# EAGLE design H00R2 (EAGLE 9.6.1)
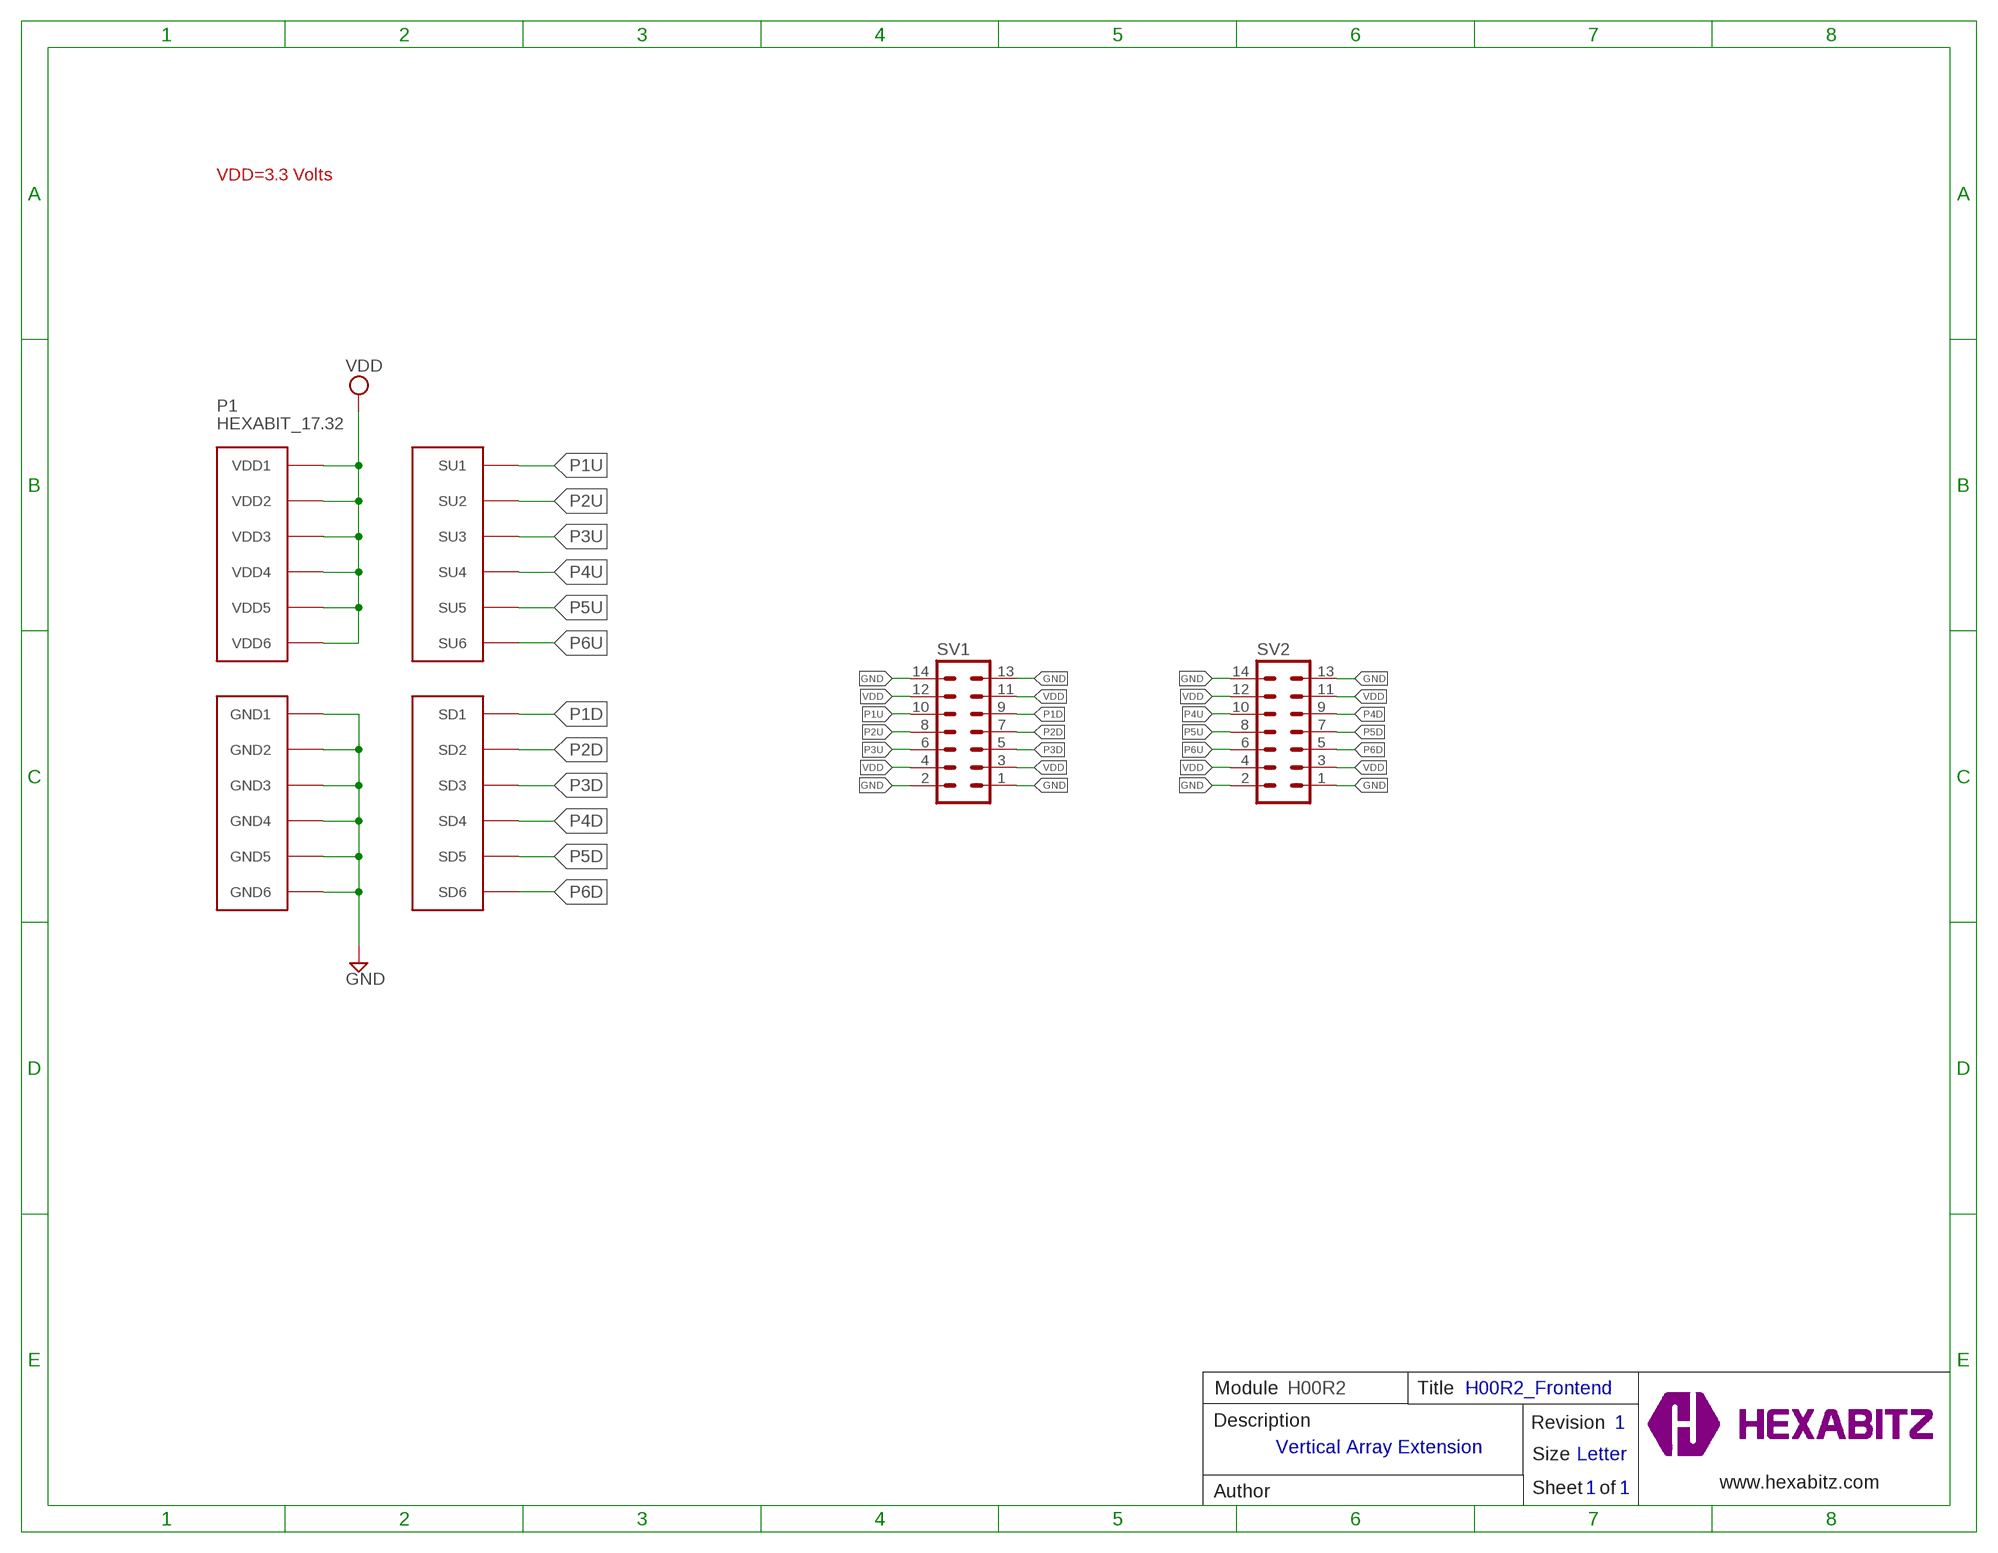
[diagram p0: schematic, sheet 1]

## Parts
P1  HEXABIT_17.32  [HEXABIT_17.32]
SV1  MA07-2  [MA07-2]
SV2  MA07-2  [MA07-2]
TRIMBLE-LOGO1  HEXA-LOGO  [HEXA-LOGO]

## Nets
GND: P1.PAD_PD7(GND1) P1.PAD_PD8(GND2) P1.PAD_PD9(GND3) P1.PAD_PD10(GND4) P1.PAD_PD11(GND5) P1.PAD_PD12(GND6) SV1.1 SV1.2 SV1.13 SV1.14 SV2.1 SV2.2 SV2.13 SV2.14
P1D: P1.PAD_PD1(SD1) SV1.9
P1U: P1.PAD_PU1(SU1) SV1.10
P2D: P1.PAD_PD2(SD2) SV1.7
P2U: P1.PAD_PU2(SU2) SV1.8
P3D: P1.PAD_PD3(SD3) SV1.5
P3U: P1.PAD_PU3(SU3) SV1.6
P4D: P1.PAD_PD4(SD4) SV2.9
P4U: P1.PAD_PU4(SU4) SV2.10
P5D: P1.PAD_PD5(SD5) SV2.7
P5U: P1.PAD_PU5(SU5) SV2.8
P6D: P1.PAD_PD6(SD6) SV2.5
P6U: P1.PAD_PU6(SU6) SV2.6
VDD: P1.PAD_PU7(VDD1) P1.PAD_PU8(VDD2) P1.PAD_PU9(VDD3) P1.PAD_PU10(VDD4) P1.PAD_PU11(VDD5) P1.PAD_PU12(VDD6) SV1.3 SV1.4 SV1.11 SV1.12 SV2.3 SV2.4 SV2.11 SV2.12

## Notes on the sheet
- VDD=3.3 Volts
- Module | H00R2 | Title | H00R2_Frontend
- Description | Revision | 1
- Vertical Array Extension
- Size | Letter
- www.hexabitz.com
- Author | Sheet   of | 1 | 1

## Library data of the parts
P1 = hexabitz_connectors:HEXABIT_?: Hexabitz Hexagon Module Connector Hexagon side length = 28.87mm.
SV1 SV2 = Hexabitz:MA07-2: PIN HEADER; OC_FARNELL: unknown; OC_NEWARK: unknown
TRIMBLE-LOGO1 = HEXABITZ_USER_INTERFACE_PARTS:HEXA-LOGO: Trimble-Logo

## Board
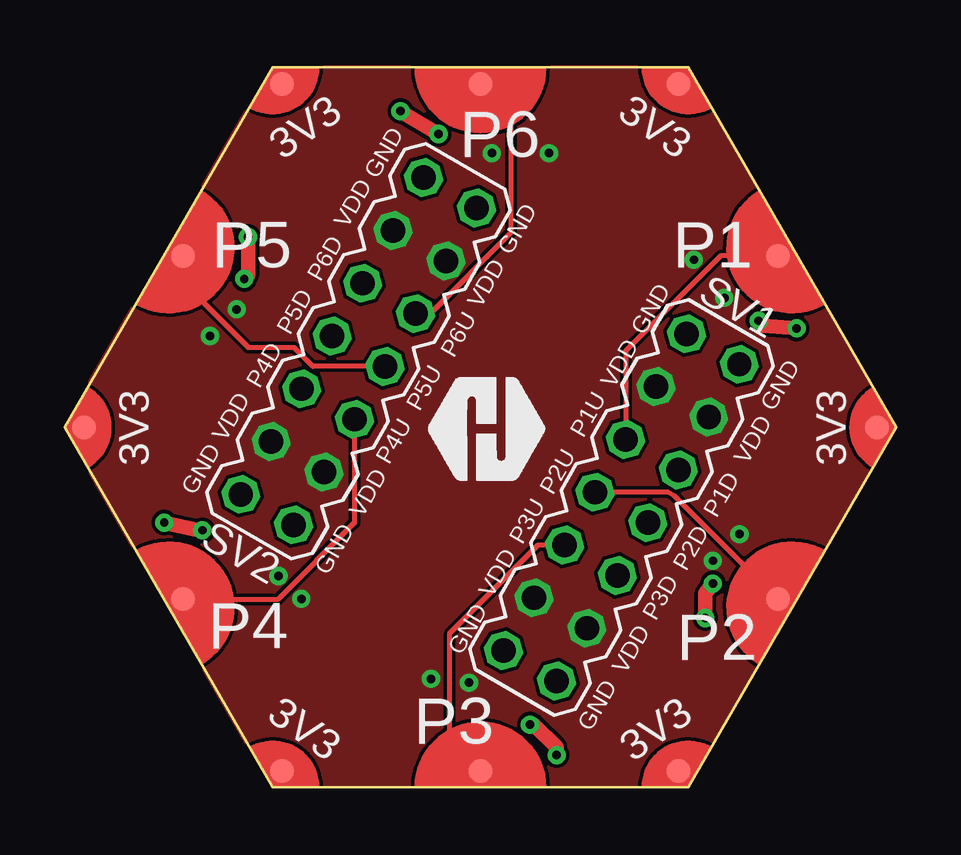
[diagram p1: board, top side]
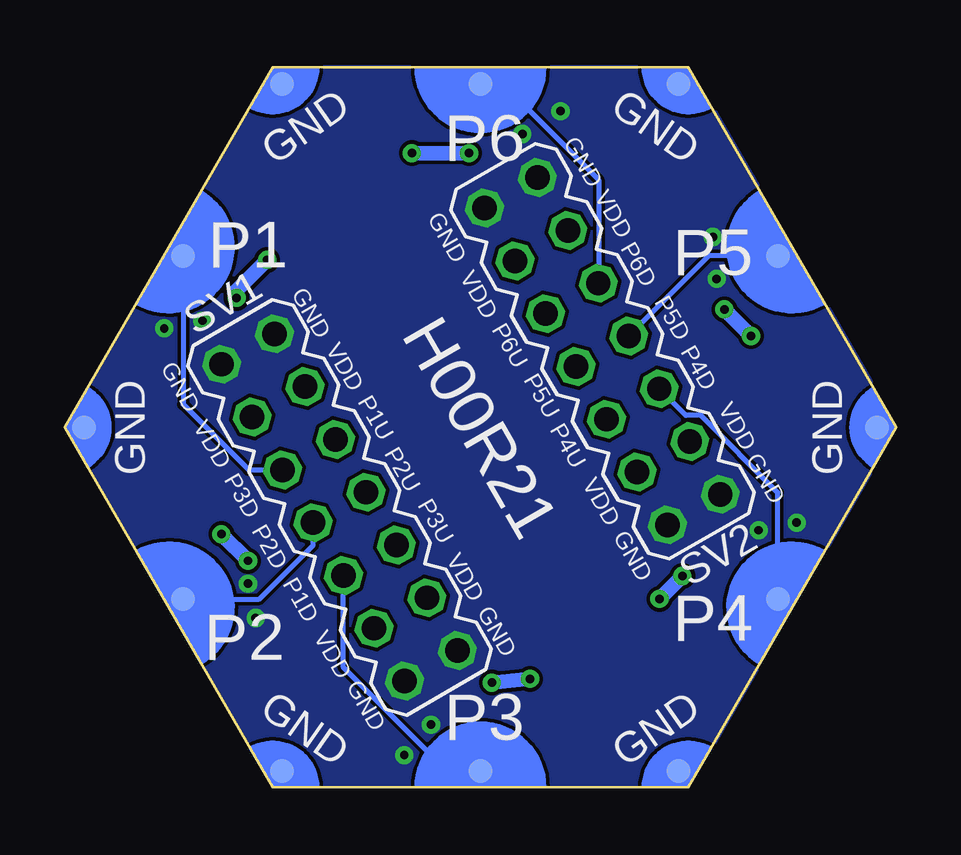
[diagram p2: board, bottom side, seen from below]

Size 34.64 x 30 mm. Coordinates in mm from the lower left corner, seen from the top.
Copper layers (1*16): Top 0.035mm / dielectric 1.5mm / Bottom 0.035mm
Design rules "2_layer *": minimum track width 6mil, minimum drill 9mil, track to track 6mil, track to pad 6mil, pad to pad 6mil, via to via 6mil, smd to smd 0mil, copper to edge 0mil, drill to drill 8mil, minimum pad ring 10mil, minimum via ring 8mil, stop-mask expansion 2mil, vias tented up to drill 15mil, thermal gap 10mil

### Footprints (pad centres in the part's own frame; a part is rotated, then mirrored left to right if it is on the bottom)
HEXABIT_17.32 = smd 1 x 1 bottom: PAD_PD1 12.39,7.15; PAD_PD2 12.39,-7.15; PAD_PD3 0,-14.31; PAD_PD4 -12.39,-7.15; PAD_PD5 -12.39,7.15; PAD_PD6 0,14.31; PAD_PD7 8.26,14.31; PAD_PD8 16.52,0; PAD_PD9 8.26,-14.31; PAD_PD10 -8.26,-14.31; PAD_PD11 -16.52,0; PAD_PD12 -8.26,14.31 | smd 1 x 1: PAD_PU1 12.39,7.15; PAD_PU2 12.39,-7.15; PAD_PU3 0,-14.31; PAD_PU4 -12.39,-7.15; PAD_PU5 -12.39,7.15; PAD_PU6 0,14.31; PAD_PU7 8.26,14.31; PAD_PU8 16.52,0; PAD_PU9 8.26,-14.31; PAD_PU10 -8.26,-14.31; PAD_PU11 -16.52,0; PAD_PU12 -8.26,14.31
MA07-2 = drill 1.016 octagon: 1 -7.62,-1.27; 2 -7.62,1.27; 3 -5.08,-1.27; 4 -5.08,1.27; 5 -2.54,-1.27; 6 -2.54,1.27; 7 0,-1.27; 8 0,1.27; 9 2.54,-1.27; 10 2.54,1.27; 11 5.08,-1.27; 12 5.08,1.27; 13 7.62,-1.27; 14 7.62,1.27

### Placement (x,y rotation side)
P1  17.32,15 0 top
SV1  23.19,11.67 60 top
SV2  12.24,18.18 240 top
TRIMBLE-LOGO1  17.64,12.78 0 top

### Tracks (layer width: path | path; a pad name or v marks a point on that pad's centre or on a via)
GND  (via drill 0.35 pad 0.75)
  Top 0.61: v13.99,28.18 v15.57,27.22 | v30.5,19.13 29.11,19.24 v28.91,19.44 | v7.48,21.19 7.64,21.35 v7.64,22.94 | v5.73,10.71 5.67,10.69 v4.14,11.03 | v20.5,1.35 20.5,1.66 19.54,2.62 v19.38,2.62 | v27,8.49 26.69,8.08 v26.69,7.06
  pour Bottom (no thermals): 8.62,0.03 25.94,0.03 34.6,15.03 25.94,30.03 8.62,30.03 -0.04,15.03
P1D
  Bottom 0.203: P1.PAD_PD1 29.71,15.96 26.98,13.23 SV1.9
P1U
  Top 0.203: P1.PAD_PU1 27.33,22.15 23.36,18.19 SV1.10
P2D
  Bottom 0.203: P1.PAD_PD2 26.53,7.85 24.29,10.09 SV1.7
P2U
  Top 0.203: P1.PAD_PU2 25.42,12.14 25.14,12.3 SV1.8
P3D
  Bottom 0.203: P1.PAD_PD3 18.73,0.69 23.04,5 23.04,8.82 SV1.5
P3U
  Top 0.203: P1.PAD_PU3 16.05,1.96 16.05,6.43 19.72,10.1 SV1.6
P4D
  Bottom 0.203: SV2.9 8.76,15.5 8.15,15.5 4.93,12.28 P1.PAD_PD4
P4U
  Top 0.203: P1.PAD_PU4 8.9,7.85 12.07,11.02 SV2.10
P5D
  Bottom 0.203: P1.PAD_PD5 7.8,22.15 SV2.7
P5U
  Top 0.203: P1.PAD_PU5 4.93,21.04 7.64,18.33 9.54,18.33 10.34,17.54 SV2.8
P6D
  Bottom 0.203: P1.PAD_PD6 16.39,29.31 12.4,25.32 12.4,21.02 SV2.5
P6U
  Top 0.203: P1.PAD_PU6 18.59,28.04 18.59,23.11 15.22,19.74 SV2.6
VDD  (via drill 0.35 pad 0.75)
  Bottom 0.61: v17.8,26.43 v20.18,26.43 | v7.16,19.92 v6.05,18.81 | v26.21,21.98 27.57,20.62 v27.48,20.4 | v27,9.44 v28.12,10.55 | v16.84,4.36 v15.26,4.52 | v9.86,7.86 v8.91,8.81
  pour Top (no thermals): 8.62,0.03 25.94,0.03 34.6,15.03 25.94,30.03 8.62,30.03 -0.04,15.03

### Text on the board
tPlace: 3V3 | 3V3 | P6 | P5 | P1 | 3V3 | 3V3 | P4 | P2 | 3V3 | P3 | 3V3
bPlace: GND | GND | P6 | P1 | P5 | GND | H00R21 | GND | P4 | P2 | GND | P3 | GND
tNames: GND | VDD | GND | P6D | VDD | P5D | GND | P6U | P4D | VDD | P5U | GND | P1U | VDD | P4U | VDD | GND | P2U | VDD | P1D | P3U | GND | P2D | VDD | P3D | GND | VDD | GND
bNames: GND | VDD | GND | P6D | VDD | GND | P5D | P6U | SV1 | P4D | VDD | GND | P5U | VDD | P1U | P4U | VDD | GND | P2U | VDD | P3D | P3U | GND | P2D | VDD | P1D | SV2 | GND | VDD | GND